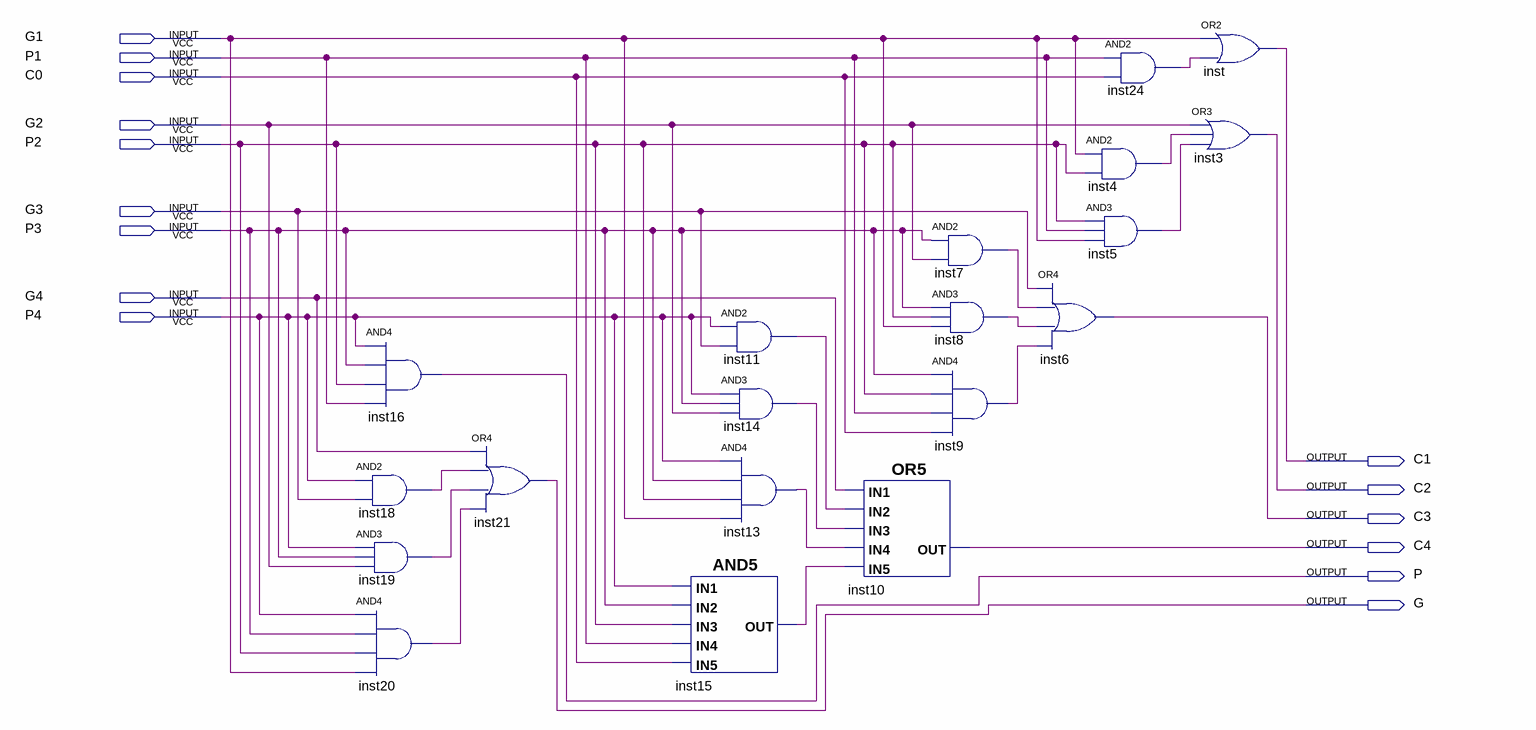
[diagram p0: schematic sheet]
// Quartus schematic carryLookaheadLogic3.bdf as structural Verilog: 19 symbols, 15 pins
module carryLookaheadLogic3 (
  input  G1,
  input  P1,
  input  C0,
  input  G2,
  input  P2,
  input  G3,
  input  P3,
  input  G4,
  input  P4,
  output C1,
  output C2,
  output C3,
  output C4,
  output P,
  output G
);

  wire inst4_out, inst5_out, inst7_out, inst8_out, inst9_out, inst11_out, inst13_out, inst14_out, inst15_out,
       inst18_out, inst19_out, inst20_out, inst24_out;

  and inst16 (P, P4, P3, P2, P1);
  and inst18 (inst18_out, P4, G3);
  and inst19 (inst19_out, P4, P3, G2);
  and inst20 (inst20_out, P4, P3, P2, G1);
  or inst21 (G, G4, inst18_out, inst19_out, inst20_out);
  and inst15 (inst15_out, P4, P3, P2, P1, C0);
  and inst11 (inst11_out, P4, G3);
  and inst14 (inst14_out, P4, P3, G2);
  and inst13 (inst13_out, P4, P3, P2, G1);
  or inst10 (C4, G4, inst11_out, inst14_out, inst13_out, inst15_out);
  and inst7 (inst7_out, P3, G2);
  and inst8 (inst8_out, P3, P2, G1);
  and inst9 (inst9_out, P3, P2, P1, C0);
  and inst4 (inst4_out, G1, P2);
  and inst5 (inst5_out, P2, P1, G1);
  or inst6 (C3, G3, inst7_out, inst8_out, inst9_out);
  and inst24 (inst24_out, P1, C0);
  or inst (C1, G1, inst24_out);
  or inst3 (C2, G2, inst4_out, inst5_out);
endmodule
